# EAGLE design Dumber (EAGLE 5.11)
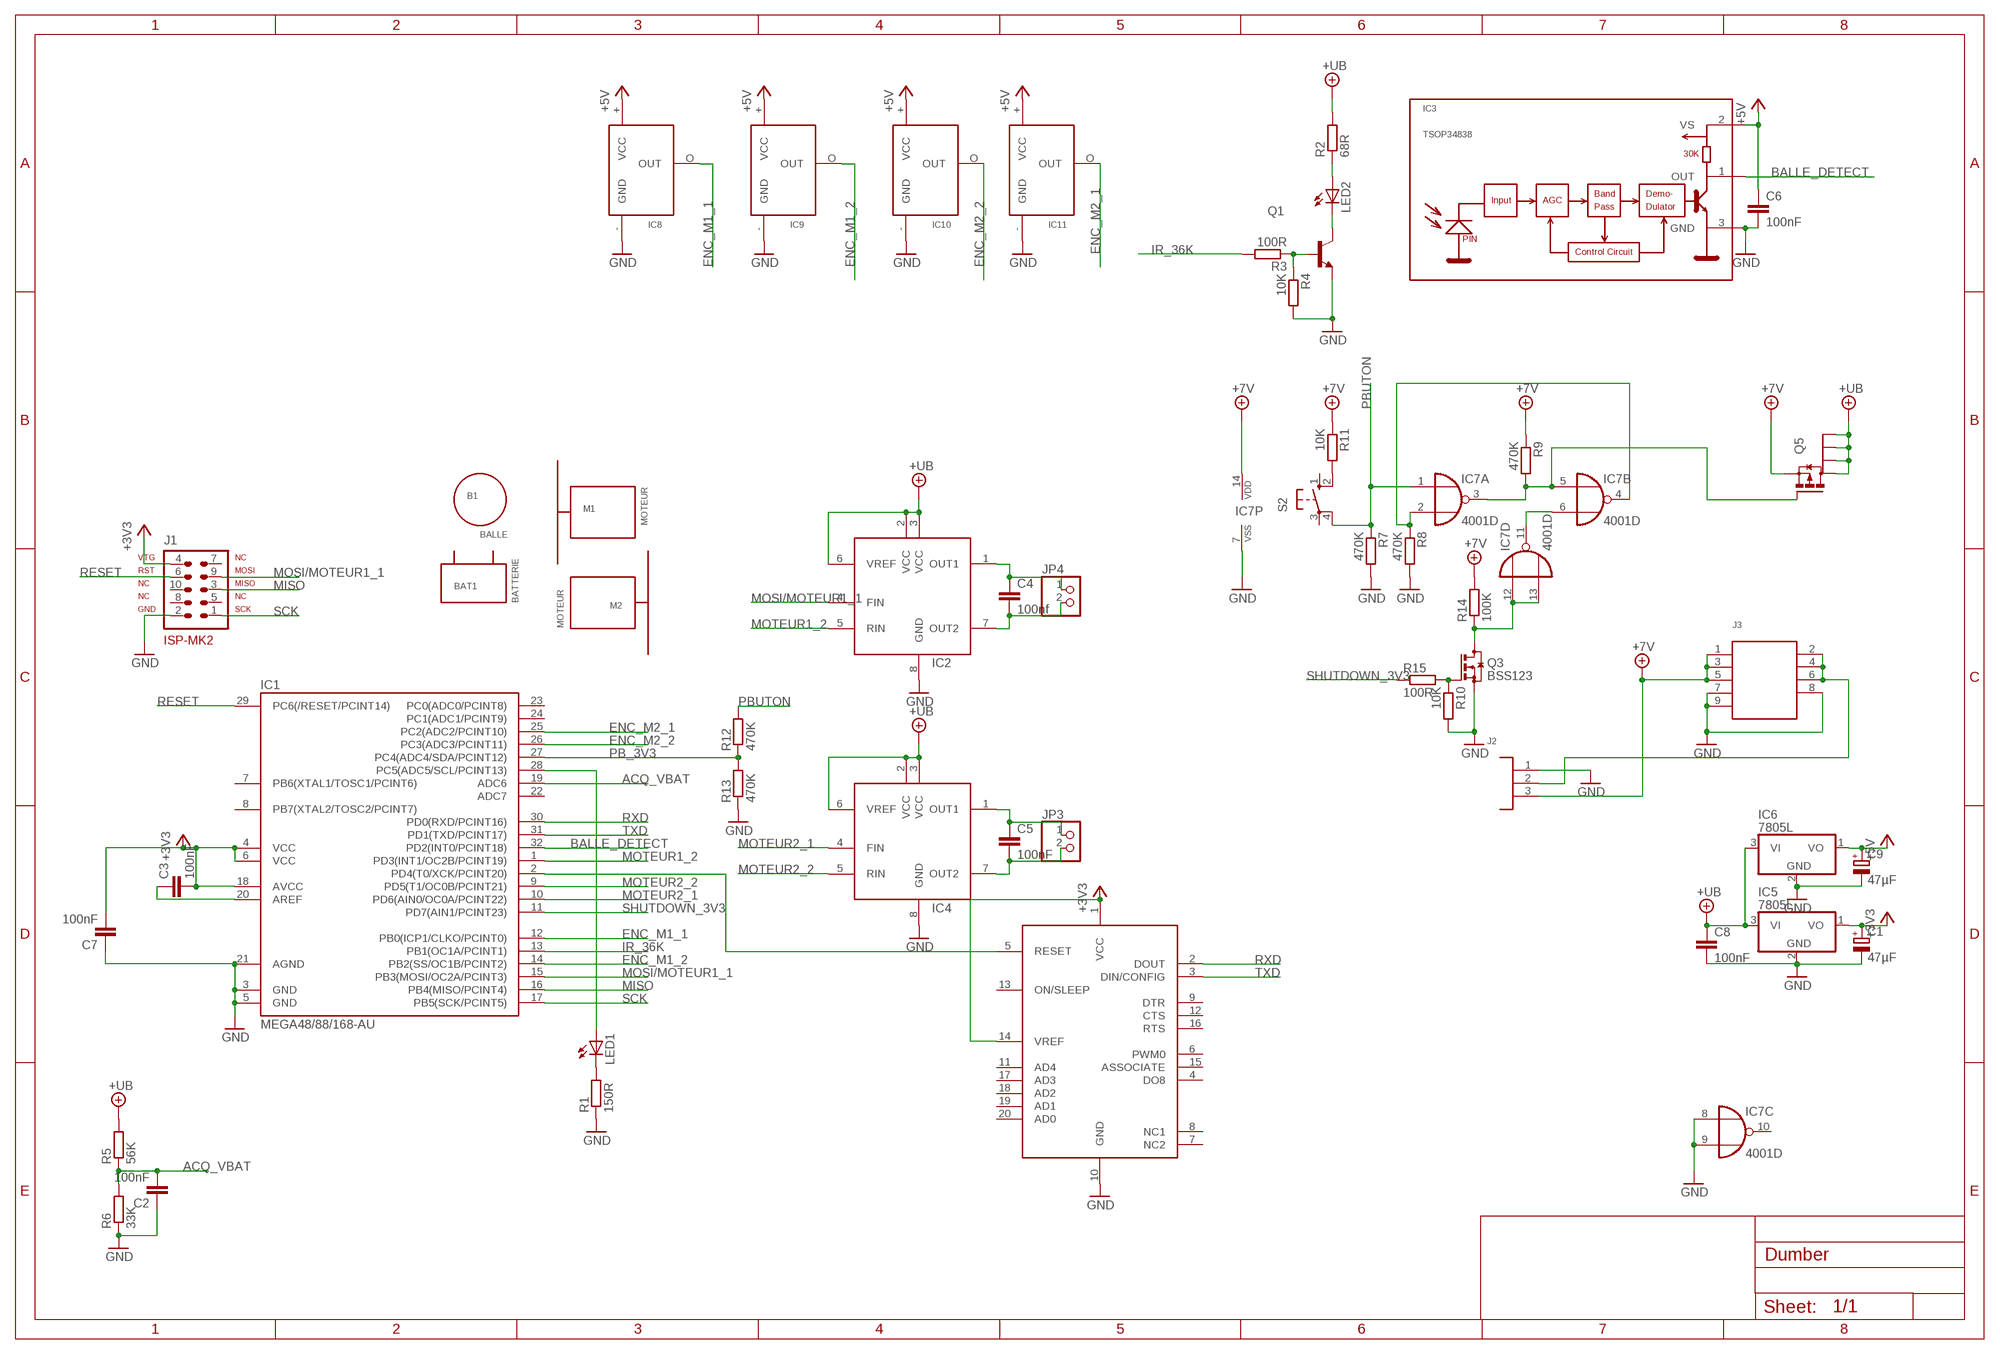
[diagram p0: schematic, sheet 1]

## Parts
B1  BALLE  [BALLE]
BAT1  BATTERIE  [BATTERIE]
C1  47µF  CPOL-EUD/7343-31R  [D/7343-31R]
C2  100nF  C-EUC1206  [C1206]
C3  100nF  C-EUC1206  [C1206]
C4  100nf  C-EUC1206  [C1206]
C5  100nF  C-EUC1206  [C1206]
C6  100nF  C-EUC1206  [C1206]
C7  100nF  C-EUC1206  [C1206]
C8  100nF  C-EUC1206  [C1206]
C9  47µF  CPOL-EUD/7343-31R  [D/7343-31R]
IC1  MEGA48/88/168-AU  [TQFP32-08]
IC2  BD62XX  [SO-08]
IC3  TSOP34838  TSOP2236  [TSOP348]
IC4  BD62XX  [SO-08]
IC5  7805L  [TO92]
IC6  7805L  [TO92]
IC7  4001D  [SO14]
IC8  2SS52M  [2SS]
IC9  2SS52M  [2SS]
IC10  2SS52M  [2SS]
IC11  2SS52M  [2SS]
IC12  XBEE  [XBEE]
J1  AVR-ISP-MK2  [AVR-ISP-10]
J2  3XH  [3XH]
J3  M40-9-F  [M40-600-9]
JP3  PINHD-1X2  [1X02]
JP4  PINHD-1X2  [1X02]
LED1  LEDKA-3528ASYC  [KA-3528ASYC]
LED2  LED5MM  [LED5MM]
M1  MOTEUR  [MOTEUR]
M2  MOTEUR  [MOTEUR]
Q1  BCP56  [SOT223]
Q3  BSS123  [SOT23]
Q5  RTQ030P02TR  [TSMT-6]
R1  150R  R-EU_M0805  [M0805]
R2  68R  R-EU_M0805  [M0805]
R3  100R  R-EU_R1206W  [R1206W]
R4  10K  R-EU_R1206W  [R1206W]
R5  56K  R-EU_M0805  [M0805]
R6  33K  R-EU_M0805  [M0805]
R7  470K  R-EU_R1206W  [R1206W]
R8  470K  R-EU_R1206W  [R1206W]
R9  470K  R-EU_R1206W  [R1206W]
R10  10K  R-EU_R1206W  [R1206W]
R11  10K  R-EU_R1206W  [R1206W]
R12  470K  R-EU_R1206W  [R1206W]
R13  470K  R-EU_R1206W  [R1206W]
R14  100K  R-EU_R1206W  [R1206W]
R15  100R  R-EU_R1206W  [R1206W]
S2  10-XX  [B3F-10XX]

## Nets
+3V3: C1.+ C3.2 C7.2 IC1.4(VCC) IC1.6(VCC) IC1.18(AVCC) IC5.1(VO) IC12.1(VCC) IC12.14(VREF) J1.4(VTG)
+5V: C6.1 C9.+ IC3.2(VS) IC6.1(VO) IC8.+(VCC) IC9.+(VCC) IC10.+(VCC) IC11.+(VCC)
+7V: IC7.14(P:VDD) J2.3 J3.1 J3.3 J3.5 Q5.4(S) R9.1 R11.1 R14.2
+UB: C8.1 IC2.2(VCC) IC2.3(VCC) IC2.6(VREF) IC4.2(VCC) IC4.3(VCC) IC4.6(VREF) IC5.3(VI) IC6.3(VI) Q5.1(D) Q5.2(D) Q5.5(D) Q5.6(D) R2.2 R5.2
ACQ_VBAT: C2.2 IC1.19(ADC6) R5.1 R6.2
BALLE_DETECT: IC1.32(PD2(INT0/PCINT18)) IC3.1(OUT)
ENC_M1_1: IC1.12(PB0(ICP1/CLKO/PCINT0)) IC8.O(OUT)
ENC_M1_2: IC1.14(PB2(SS/OC1B/PCINT2)) IC9.O(OUT)
ENC_M2_1: IC1.25(PC2(ADC2/PCINT10)) IC11.O(OUT)
ENC_M2_2: IC1.26(PC3(ADC3/PCINT11)) IC10.O(OUT)
GND: C1.- C2.1 C6.2 C7.1 C8.2 C9.- IC1.3(GND) IC1.5(GND) IC1.21(AGND) IC2.8(GND) IC3.3(GND) IC4.8(GND) IC5.2(GND) IC6.2(GND) IC7.7(P:VSS) IC7.8(C:I0) IC7.9(C:I1) IC8.-(GND) IC9.-(GND) IC10.-(GND) IC11.-(GND) IC12.10(GND) J1.2(GND) J2.1 J3.7 J3.8 J3.9 Q1.3(E) Q3.2(S) R1.1 R4.2 R6.1 R7.2 R8.2 R10.2 R13.1
IR_36K: IC1.13(PB1(OC1A/PCINT1)) R3.2
MISO: IC1.16(PB4(MISO/PCINT4)) J1.3(MISO)
MOSI/MOTEUR1_1: IC1.15(PB3(MOSI/OC2A/PCINT3)) IC2.4(FIN) J1.9(MOSI)
MOTEUR1_2: IC1.1(PD3(INT1/OC2B/PCINT19)) IC2.5(RIN)
MOTEUR2_1: IC1.10(PD6(AIN0/OC0A/PCINT22)) IC4.4(FIN)
MOTEUR2_2: IC1.9(PD5(T1/OC0B/PCINT21)) IC4.5(RIN)
N$1: R11.2 S2.2(S1)
N$2: IC1.28(PC5(ADC5/SCL/PCINT13)) LED1.A
N$3: LED1.C R1.2
N$5: C3.1 IC1.20(AREF)
N$6: IC1.2(PD4(T0/XCK/PCINT20)) IC12.5(RESET)
N$9: C4.1 IC2.1(OUT1) JP4.1
N$10: C4.2 IC2.7(OUT2) JP4.2
N$11: C5.1 IC4.1(OUT1) JP3.1
N$12: C5.2 IC4.7(OUT2) JP3.2
N$14: Q1.1(B) R3.1 R4.1
N$15: LED2.K(C) Q1.2(C)
N$16: LED2.A R2.1
N$17: IC7.3(A:O) IC7.5(B:I0) Q5.3(G) R9.2
N$18: IC7.12(D:I0) IC7.13(D:I1) Q3.3(D) R14.1
N$19: J2.2 J3.2 J3.4 J3.6
N$20: Q3.1(G) R10.1 R15.2
N$21: IC7.2(A:I1) IC7.4(B:O) R8.1
PB_3V3: IC1.27(PC4(ADC4/SDA/PCINT12)) R12.1 R13.2
PBUTON: IC7.1(A:I0) R7.1 R12.2 S2.4(P1)
RESET: IC1.29(PC6(/RESET/PCINT14)) J1.6(RST)
RXD: IC1.30(PD0(RXD/PCINT16)) IC12.2(DOUT)
SCK: IC1.17(PB5(SCK/PCINT5)) J1.1(SCK)
SHUTDOWN: IC7.6(B:I1) IC7.11(D:O)
SHUTDOWN_3V3: IC1.11(PD7(AIN1/PCINT23)) R15.1
TXD: IC1.31(PD1(TXD/PCINT17)) IC12.3(DIN/CONFIG)
Unconnected: IC1.7(PB6(XTAL1/TOSC1/PCINT6)) IC1.8(PB7(XTAL2/TOSC2/PCINT7)) IC1.22(ADC7) IC1.23(PC0(ADC0/PCINT8)) IC1.24(PC1(ADC1/PCINT9)) IC7.10(C:O) IC12.4(DO8) IC12.6(PWM0) IC12.7(NC2) IC12.8(NC1) IC12.9(DTR) IC12.11(AD4) IC12.12(CTS) IC12.13(ON/SLEEP) IC12.15(ASSOCIATE) IC12.16(RTS) IC12.17(AD3) IC12.18(AD2) IC12.19(AD1) IC12.20(AD0) J1.5(NC) J1.7(NC) J1.8(NC) J1.10(NC) S2.1(S) S2.3(P)

## Library data of the parts
B1 = dumber:BALLE
BAT1 = dumber:BATTERIE
C1 C9 = rcl:CPOL-EU: POLARIZED CAPACITOR, European symbol
C2-C8 = rcl:C-EU: CAPACITOR, European symbol
IC1 = avr-5:MEGA48/88/168
IC2 IC4 = transistor-power:BD62XX
IC3 = vishay-1:TSOP2236
IC5 IC6 = linear:78*: Positive VOLTAGE REGULATOR Source: http://cache.national.com/ds/LM/LM78L05.pdf http://www.fairchildsemi.com/ds/LM/LM7805.pdf
IC7 = 40xx:4001: Quad 2-input NOR
IC8-IC11 = dumber:2SS52M
IC12 = Xbee:XBEE
J1 = avr-5:AVR-ISP-MK2
J2 = con-jst:3XH
J3 = con-harwing:M40-9
JP3 JP4 = pinhead:PINHD-1X2: PIN HEADER
LED1 LED2 = led:LED: LED OSRAM: - CHIPLED LG R971, LG N971, LY N971, LG Q971, LY Q971, LO R971, LY R971 LH N974, LH R974 LS Q976, LO Q976, LY Q976 LO Q996 - Hyper CHIPLED LW Q18S LB Q993, LB Q99A, LB R99A - SideLED LS A670, LO A670, LY A670, LG A670, LP A670 LB A673, LV A673, LT A673, LW A673 LH A674 LY A675 LS A676, LA A676, LO A676, LY A676, LW A676 LS A679, LY A679, LG A679 - Hyper Micro SIDELED® LS Y876, LA Y876, LO Y876, LY Y876 LT Y87S - SmartLED LW L88C, LW L88S LB L89C, LB L89S, LG L890 LS L89K, LO L89K, LY L89K LS L896, LA L896, LO L896, LY L896 - TOPLED LS T670, LO T670, LY T670, LG T670, LP T670 LSG T670, LSP T670, LSY T670, LOP T670, LYG T670 LG T671, LOG T671, LSG T671 LB T673, LV T673, LT T673, LW T673 LH T674 LS T676, LA T676, LO T676, LY T676, LB T676, LH T676, LSB T676, LW T676 LB T67C, LV T67C, LT T67C, LS T67K, LO T67K, LY T67K, LW E67C LS E67B, LA E67B, LO E67B, LY E67B, LB E67C, LV E67C, LT E67C LW T67C LS T679, LY T679, LG T679 LS T770, LO T770, LY T770, LG T770, LP T770 LB T773, LV T773, LT T773, LW T773 LH T774 LS E675, LA E675, LY E675, LS T675 LS T776, LA T776, LO T776, LY T776, LB T776 LHGB T686 LT T68C, LB T68C - Hyper Mini TOPLED® LB M676 - Mini TOPLED Santana® LG M470 LS M47K, LO M47K, LY M47K Source: http://www.osram.convergy.de LUXEON: - LUMILED® LXK2-PW12-R00, LXK2-PW12-S00, LXK2-PW14-U00, LXK2-PW14-V00 LXK2-PM12-R00, LXK2-PM12-S00, LXK2-PM14-U00 LXK2-PE12-Q00, LXK2-PE12-R00, LXK2-PE12-S00, LXK2-PE14-T00, LXK2-PE14-U00 LXK2-PB12-K00, LXK2-PB12-L00, LXK2-PB12-M00, LXK2-PB14-N00, LXK2-PB14-P00, LXK2-PB14-Q00 LXK2-PR12-L00, LXK2-PR12-M00, LXK2-PR14-Q00, LXK2-PR14-R00 LXK2-PD12-Q00, LXK2-PD12-R00, LXK2-PD12-S00 LXK2-PH12-R00, LXK2-PH12-S00 LXK2-PL12-P00, LXK2-PL12-Q00, LXK2-PL12-R00 Source: www.luxeon.com KINGBRIGHT: KA-3528ASYC Source: www.kingbright.com
M1 M2 = dumber:MOTEUR
Q1 = transistor-npn:BCP56
Q3 = transistor-small-signal:BSS123: N-CHANNEL MOS FET
Q5 = dumber:RTQ030P02TR
R1-R15 = rcl:R-EU_: RESISTOR, European symbol
S2 = switch-omron:10-XX: OMRON SWITCH

## Board
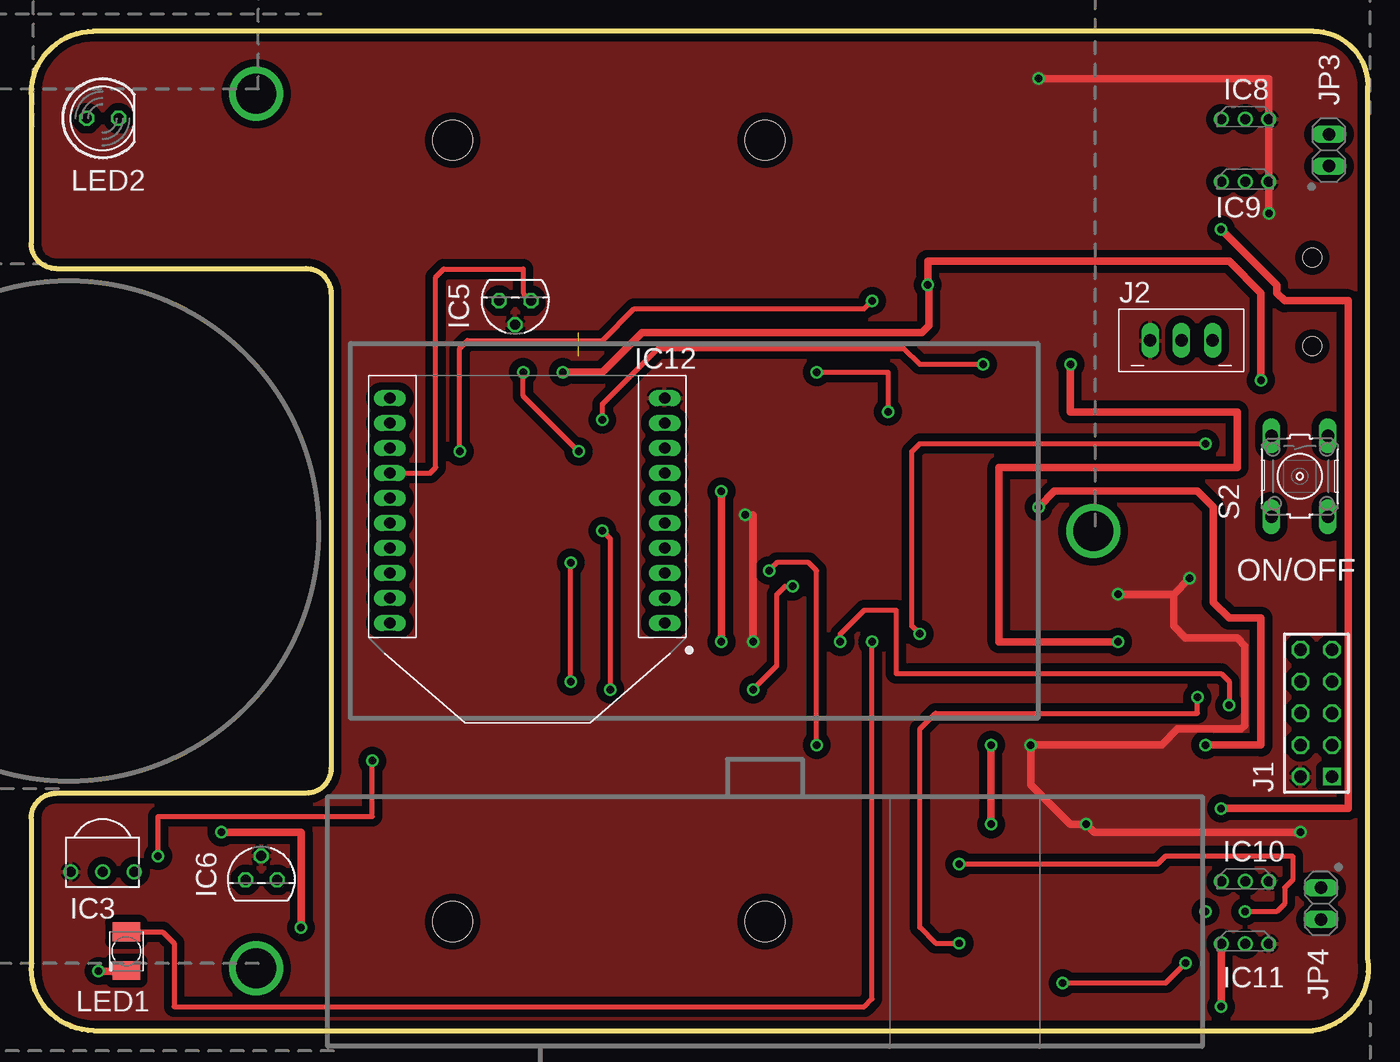
[diagram p1: board, top side]
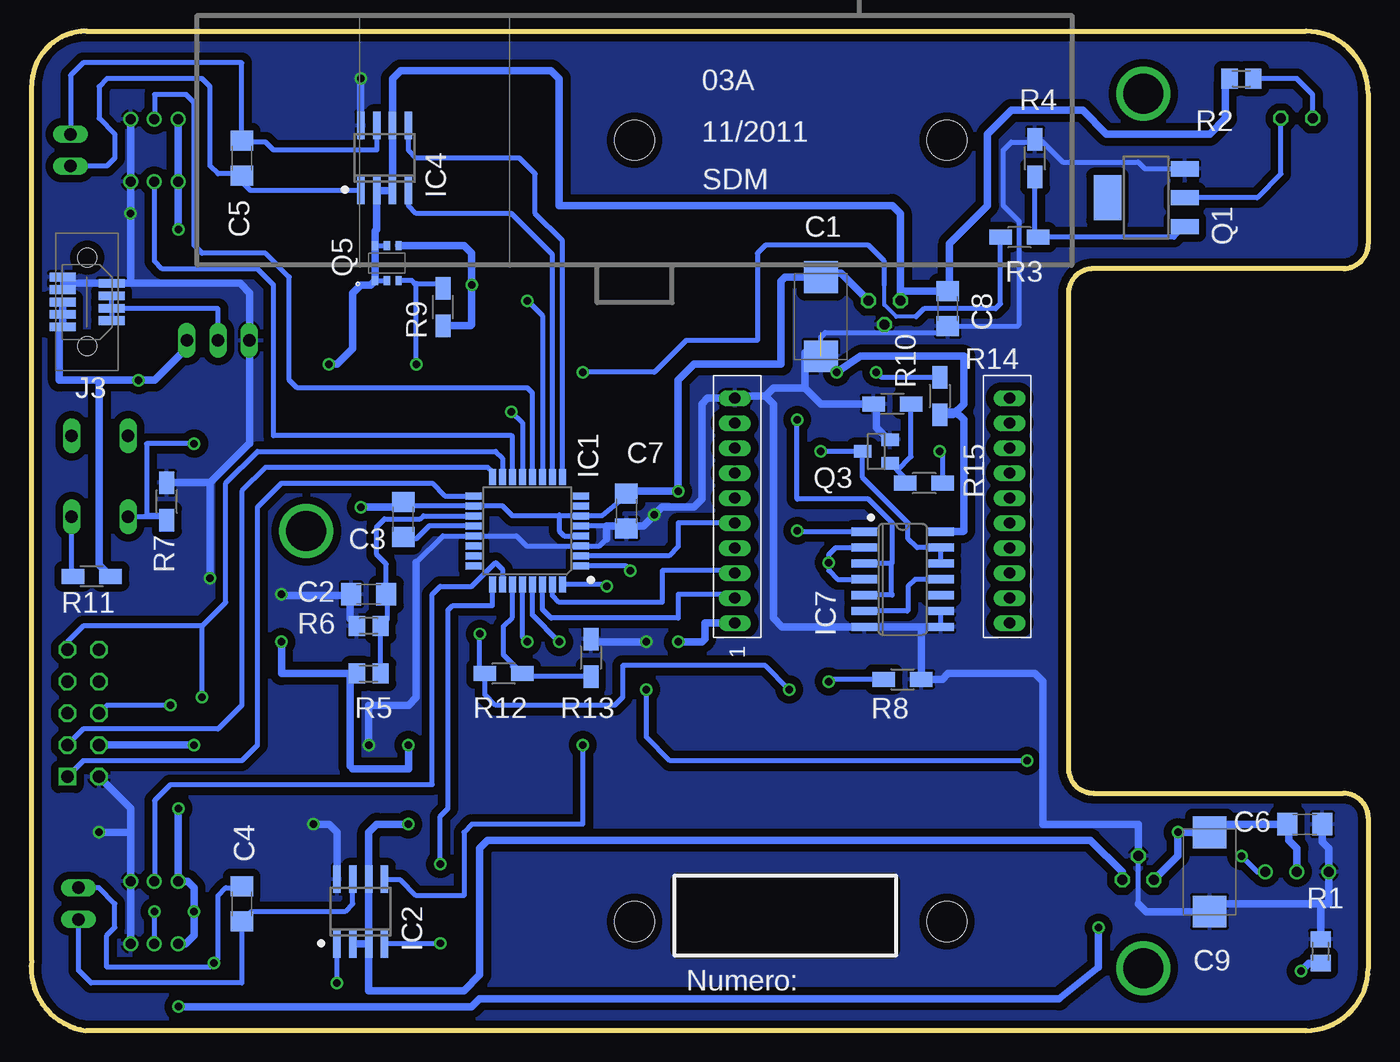
[diagram p2: board, bottom side, seen from below]

Size 107.02 x 80 mm. Coordinates in mm from the lower left corner, seen from the top.
Outline: 5,0 102.62,0 arc90 106.98,5.63 106.98,75.63 arc90 102.62,80 5,80 arc90 0,75 0,63 arc90 2,61 22,61 arc-90 24,59 24,21 arc-90 22,19 2,19 arc90 0,17 0,5 arc90 5,0
Copper layers (1*16): Top 0.035mm / dielectric 1.5mm / Bottom 0.035mm
Design rules "PCB-POOL Standard": minimum track width 0.15mm, minimum drill 0.3mm, track to track 0.15mm, track to pad 0.15mm, pad to pad 0.15mm, via to via 0.15mm, smd to smd 0.15mm, copper to edge 0.3mm, drill to drill 0.2mm, minimum pad ring 0.2mm, minimum via ring 0.2mm, stop-mask expansion 0.075mm, vias tented up to drill 0mil, thermal gap 0.2mm
tRestrict: 16 lines
bRestrict: area 38.1,6.3 to 55.2,12.1; 16 lines

### Footprints (pad centres in the part's own frame; a part is rotated, then mirrored left to right if it is on the bottom)
D/7343-31R = smd 2.55 x 2.7: + 3.175,0; - -3.175,0
C1206 = smd 1.6 x 1.8: 1 -1.4,0; 2 1.4,0
TQFP32-08 = smd 1.27 x 0.559: 1 -4.293,2.8; 2 -4.293,2; 3 -4.293,1.2; 4 -4.293,0.4; 5 -4.293,-0.4; 6 -4.293,-1.2; 7 -4.293,-2; 8 -4.293,-2.8; 17 4.293,-2.8; 18 4.293,-2; 19 4.293,-1.2; 20 4.293,-0.4; 21 4.293,0.4; 22 4.293,1.2; 23 4.293,2; 24 4.293,2.8 | smd 0.559 x 1.27: 9 -2.8,-4.293; 10 -2,-4.293; 11 -1.2,-4.293; 12 -0.4,-4.293; 13 0.4,-4.293; 14 1.2,-4.293; 15 2,-4.293; 16 2.8,-4.293; 25 2.8,4.293; 26 2,4.293; 27 1.2,4.293; 28 0.4,4.293; 29 -0.4,4.293; 30 -1.2,4.293; 31 -2,4.293; 32 -2.8,4.293
SO-08 = smd 0.6 x 2.2: 1 -1.905,-2.6; 2 -0.635,-2.6; 3 0.635,-2.6; 4 1.905,-2.6; 5 1.905,2.6; 6 0.635,2.6; 7 -0.635,2.6; 8 -1.905,2.6
TSOP348 = drill 0.8 round: 1 -2.54,0; 2 0,0; 3 2.54,0
TO92 = drill 0.8 octagon: 1 -1.27,0; 2 0,1.905; 3 1.27,0
SO14 = smd 0.66 x 2.032: 1 -3.81,-3.073; 2 -2.54,-3.073; 3 -1.27,-3.073; 4 0,-3.073; 5 1.27,-3.073; 6 2.54,-3.073; 7 3.81,-3.073; 8 3.81,3.073; 9 2.54,3.073; 10 1.27,3.073; 11 0,3.073; 12 -1.27,3.073; 13 -2.54,3.073; 14 -3.81,3.073
2SS = drill 0.8 round: + 1.905,-0.584; - -1.905,-0.584; O 0,-0.584
XBEE = drill 0.9 pad 1.27 long: 1 -11,9; 2 -11,7; 3 -11,5; 4 -11,3; 5 -11,1; 6 -11,-1; 7 -11,-3; 8 -11,-5; 9 -11,-7; 10 -11,-9; 11 11,-9; 12 11,-7; 13 11,-5; 14 11,-3; 15 11,-1; 16 11,1; 17 11,3; 18 11,5; 19 11,7; 20 11,9
AVR-ISP-10 = drill 1 square: 1 -5.08,-1.27 | drill 1 octagon: 2 -5.08,1.27; 3 -2.54,-1.27; 4 -2.54,1.27; 5 0,-1.27; 6 0,1.27; 7 2.54,-1.27; 8 2.54,1.27; 9 5.08,-1.27; 10 5.08,1.27
3XH = drill 1 long: 1 -2.5,0; 2 0,0; 3 2.5,0
M40-600-9 = smd 0.7 x 2.08: 1 -2,1.92; 2 -1.5,-2; 3 -1,1.92; 4 -0.5,-2; 5 0,1.92; 6 0.5,-2; 7 1,1.92; 8 1.5,-2; 9 2,1.92 | hole 1.5: -3.55,-0.04; 3.55,-0.04
1X02 = drill 1 long: 1 -1.27,0; 2 1.27,0
KA-3528ASYC = smd 1.5 x 2.2: A -1.55,0; C 1.55,0
LED5MM = drill 0.8 octagon: A -1.27,0; K 1.27,0
MOTEUR = hole 3.2: 10,0; 10,-25
SOT223 = smd 1.219 x 2.235: 1 -2.311,-3.099; 2 0,-3.099; 3 2.311,-3.099 | smd 3.6 x 2.2: 4 0,3.099
SOT23 = smd 1 x 1.4: 1 -0.95,-1.1; 2 0.95,-1.1; 3 0,1.1
TSMT-6 = smd 0.5 x 0.7: 1 0.5,-0.6; 2 1.45,-0.6; 3 2.4,-0.6; 4 2.4,2.2; 5 1.45,2.2; 6 0.5,2.2
M0805 = smd 1.3 x 1.6: 1 -0.95,0; 2 0.95,0
R1206W = smd 1.8 x 1.2: 1 -1.499,0; 2 1.499,0
B3F-10XX = drill 1 long: 1 -3.251,2.261; 2 3.251,2.261; 3 -3.251,-2.261; 4 3.251,-2.261

### Placement (x,y rotation side)
B1  3,40 0 top
BAT1  25.57,25 90 top
C1  43.81,57.15 90 bottom
C2  80.01,34.93 0 bottom
C3  77.25,40.93 90 bottom
C4  90.17,10.16 270 bottom
C5  90.17,69.85 90 bottom
C6  5.08,16.51 0 bottom
C7  59.37,41.59 90 bottom
C8  33.66,57.79 270 bottom
C9  12.7,12.7 90 bottom
IC1  67.31,40.01 180 bottom
IC2  80.64,9.53 0 bottom
IC3  5.71,12.7 180 top
IC4  78.74,69.85 0 bottom
IC5  38.73,58.42 180 top
IC6  18.41,12.06 0 top
IC7  37.27,36.12 270 bottom
IC8  97.17,72.36 180 top
IC9  97.17,67.36 180 top
IC10  97.17,11.37 180 top
IC11  97.17,6.37 180 top
IC12  39.71,41.63 180 top
J1  102.87,25.4 90 top
J2  92.08,55.25 0 top
J3  102.6,58.33 90 bottom
JP3  103.87,70.48 90 top
JP4  103.23,10.16 270 top
LED1  7.62,6.35 270 top
LED2  5.71,73.02 0 top
M1  33.73,-1.27 90 top
M2  33.73,81.27 270 bottom
Q1  17.78,66.67 90 bottom
Q3  39.37,46.36 90 bottom
Q5  80.01,60.64 0 bottom
R1  3.81,6.35 270 bottom
R2  10.16,76.2 180 bottom
R3  27.94,63.5 180 bottom
R4  26.67,69.85 90 bottom
R5  80.01,28.57 180 bottom
R6  80.01,32.39 0 bottom
R7  96.17,42.37 90 bottom
R8  37.27,28.12 0 bottom
R9  74.06,57.92 90 bottom
R10  38.1,50.16 180 bottom
R11  102.17,36.37 180 bottom
R12  69.22,28.57 180 bottom
R13  62.23,29.84 270 bottom
R14  34.29,50.8 270 bottom
R15  35.56,43.82 180 bottom
S2  101.54,44.37 270 top

### Tracks (layer width: path | path; a pad name or v marks a point on that pad's centre or on a via)
+3V3  (via drill 0.6)
  Top 0.406: IC5.1 39.37,59.05 39.37,60.96 33.02,60.96 32.38,60.33 32.38,45.09 31.93,44.63 IC12.14
  Top 0.61: v55.24,43.18 v55.24,31.11 | v93.98,22.86 98.42,22.86 98.42,33.02 95.88,33.02 94.61,34.29 94.61,41.91 93.34,43.18 81.91,43.18 v80.64,41.91
  Bottom 0.406: IC1.6 61.35,41.21 59.69,42.55 | IC1.4 64.37,39.61 64.77,40.01 64.77,41.27 64.7,41.21 IC1.6 | IC1.6 68.51,41.21 69.31,42.01 IC1.18 76.92,42.01 C3.2 77.67,41.91 | C7.2 58.74,42.99 58.74,43.18
  Bottom 0.61: IC12.1 53.09,32.63 53.09,31.36 53.34,31.11 v55.24,31.11 | 59.69,42.55 59.05,43.18 58.74,43.18 v55.24,43.18 55.24,52.07 53.97,53.34 46.99,53.34 46.99,60.01 46.67,60.33 C1.+ 43.5,60.64 42.23,60.64 IC5.1 | v93.98,22.86 J1.4 | 77.67,41.91 v80.64,41.91
+5V  (via drill 0.6)
  Top 0.406: 95.25,6.93 IC11.+
  Top 0.61: v15.24,15.88 21.59,15.88 v21.59,8.26 | v95.25,1.91 95.25,6.93 | v95.25,17.78 105.41,17.78 105.41,58.42 100.33,58.42 99.69,59.05 99.69,59.69 v95.25,64.13
  Bottom 0.406: 6.35,16.38 C6.1 | 93.98,9.54 v94,9.53 93.98,9.51 | 95.27,17.76 v95.25,17.78 | 95.25,67.93 IC9.+
  Bottom 0.61: IC9.+ IC8.+ | IC3.2 5.71,14.61 6.35,15.24 6.35,16.38 | C6.1 12.07,16.51 C9.+ v15.24,15.88 15.24,13.97 IC6.1 | v21.59,8.26 21.59,5.08 24.77,2.54 71.12,2.54 71.75,1.91 v95.25,1.91 | 93.98,9.54 93.98,11.43 94.5,11.95 IC10.+ 95.27,17.76 | IC11.+ 94.65,6.95 93.98,7.62 93.98,9.51 | v95.25,64.13 95.25,67.93
+7V  (via drill 0.6)
  Top 0.406: 71.85,59.6 v71.75,59.69
  Top 0.61: v42.54,52.71 45.72,52.71 48.89,55.88 71.31,55.88 71.85,56.42 71.85,59.6 | v98.42,52.07 98.42,59.05 95.88,61.59 71.75,61.59 v71.75,59.69
  Bottom 0.406: 71.75,56.52 71.85,56.42 | R11.1 100.68,36.54 | 104.77,56.07 J3.1 | 32.45,39.94 32.38,40.01 | 34.06,49.53 R14.2
  Bottom 0.61: 71.85,56.42 R9.1 | 71.75,56.52 v71.75,59.69 71.75,62.23 72.37,62.84 Q5.4 | 104.77,56.07 104.77,52.07 101.6,52.07 | J3.1 J3.3 J3.5 | 101.6,52.07 v98.42,52.07 97.16,52.07 94.58,54.65 J2.3 | 32.45,39.94 IC7.14 | 32.38,40.01 32.38,48.9 33.02,49.53 34.06,49.53 | R14.2 33.25,49.3 32.38,50.16 32.38,53.98 40.64,53.98 v42.54,52.71 | 101.6,52.07 101.6,37.29 R11.1
+UB  (via drill 0.6)
  Top 0.61: v76.83,16.51 v76.83,22.86 | v86.99,31.11 77.47,31.11 77.47,45.09 96.52,45.09 96.52,49.53 83.19,49.53 v83.19,53.34
  Bottom 0.406: C8.1 33.52,59.12 | 11.43,75.97 R2.2 | IC5.3 37.46,59.06 37.33,59.19 | 37.46,63.5 37.43,63.47 | Q5.1 Q5.2 | Q5.6 Q5.5
  Bottom 0.61: IC2.3 IC2.2 | IC2.3 IC2.6 80.01,15.88 79.38,16.51 v76.83,16.51 | IC6.3 19.69,12.7 22.23,15.24 70.48,15.24 71.12,14.61 71.12,4.45 72.39,3.17 80.01,3.17 IC2.3 | 33.52,59.12 33.52,63 30.48,66.04 30.48,71.75 28.57,73.66 22.86,73.66 20.96,71.75 12.7,71.75 11.43,73.02 11.43,75.97 | 37.43,63.47 37.46,59.06 | 37.46,63.5 37.46,65.41 38.1,66.04 64.77,66.04 64.77,76.2 65.41,76.83 77.47,76.83 78.11,76.2 IC4.6 IC4.3 IC4.2 79.38,64.13 79.51,64 Q5.6 Q5.1 79.86,59.69 80.64,59.69 81.28,59.05 81.28,54.61 82.55,53.34 v83.19,53.34 | v76.83,22.86 76.83,20.95 81.28,20.95 81.51,21.18 81.51,28.49 81.6,28.57 | 37.33,59.19 C8.1 | 81.6,28.57 86.99,28.57 v86.99,31.11 | 81.6,28.57 R5.2
ACQ_VBAT
  Bottom 0.406: C2.2 78.29,34.6 | R5.1 R6.2 78.51,32.93 78.51,34.83 C2.2 | C2.2 78.61,37.34 79.38,38.1 79.38,40.32 78.74,40.96 75.88,40.96 75.63,41.21 IC1.19
BALLE_DETECT  (via drill 0.6)
  Top 0.406: v10.16,13.97 10.16,17.14 27.3,17.14 v27.3,21.59 | v57.78,27.3 59.69,29.21 59.69,34.93 60.32,35.56 v60.96,35.56
  Bottom 0.406: IC3.1 8.89,12.7 v10.16,13.97 | v27.3,21.59 55.88,21.59 57.78,23.49 v57.78,27.3 | IC1.32 61.11,35.71 v60.96,35.56
ENC_M1_1
  Bottom 0.406: IC8.O 97.16,72.97 97.16,74.93 94.61,74.93 93.98,74.3 93.98,62.87 93.34,62.23 88.27,62.23 86.36,60.33 86.36,52.07 85.72,51.44 67.31,51.44 66.91,51.04 IC1.12
ENC_M1_2
  Bottom 0.406: IC9.O 97.16,67.93 97.16,61.59 96.52,60.96 88.9,60.96 87.63,59.69 87.63,47.62 68.58,47.62 68.51,47.55 IC1.14
ENC_M2_1  (via drill 0.6)
  Top 0.406: v74.3,13.34 90.17,13.34 90.8,13.97 100.97,13.97 100.97,12.06 100.33,11.43 100.33,10.16 99.69,9.53 v97.16,9.53
  Bottom 0.406: v74.3,13.34 74.3,17.14 73.66,17.78 73.66,33.66 73.28,34.03 70.11,34.03 IC1.25 | IC11.O 97.17,9.51 v97.16,9.53
ENC_M2_2
  Bottom 0.406: IC10.O 97.16,11.97 97.16,18.41 95.88,19.68 74.93,19.68 74.93,34.93 74.3,35.56 71.75,35.56 69.85,37.47 69.31,36.93 IC1.26
GND  (via drill 0.6)  (1 unrouted)
  Top 0.406: v99.08,65.41 99.06,65.42
  Top 0.61: v80.64,76.2 99.06,76.2 99.06,65.42 | v57.15,41.27 57.78,41.27 v57.78,31.11 | v101.6,15.88 85.09,15.88 v84.45,16.51 83.19,16.51 80.01,19.68 v80.01,22.86 90.49,22.86 91.76,24.13 96.84,24.13 97.16,24.45 97.16,30.8 96.52,31.43 92.39,31.43 91.44,32.39 91.44,34.93 | 91.44,34.93 v86.99,34.93 | 91.44,34.93 v92.71,36.2
  Bottom 0.406: 50.54,50.8 IC12.10 | J3.9 J3.7 104.02,59.83 | 89.53,55.29 J2.1 89.53,55.21 | C9.- 12.7,10.16 | 18.41,10.16 IC6.2 | 99.06,59.83 99.08,59.84 | 92.71,43.86 92.66,43.86 | 89.58,46.99 89.53,46.99 | IC10.- 99.08,15.85 99.06,15.88 | R6.1 81.2,32.07 | 76.2,37.47 74.06,39.61 IC1.21 68.18,39.61 67.38,38.8 IC1.3 61.52,38.8 60.96,39.37 | 81.51,34.83 C2.1 | v86.99,34.93 86.9,34.83 | 61.75,31.11 R13.1 | 60.96,40.41 IC1.5 | 38.73,55.88 IC5.2 | 38.73,55.88 34.16,55.88 C8.2 28.07,56.39 27.94,56.52 27.94,64.77 29.21,66.04 29.21,70.48 28.57,71.12 26.9,71.12 R4.2 26.44,71.12 26.04,71.12 24.45,69.53 18.41,69.53 17.87,68.99 Q1.3 | 38.73,55.88 43.46,55.88 43.81,55.52 C1.- | 38.41,47.3 Q3.2 | R10.2 39.37,49.94 | IC7.8 IC7.9 | 35.77,32.1 35.56,32.32
  Bottom 0.61: 48.26,50.8 47.62,50.16 47.62,33.02 46.92,32.32 IC7.7 35.56,32.32 IC7.8 | 48.26,50.8 50.54,50.8 | IC11.- IC10.- 99.08,17.8 J1.2 | 104.02,59.83 J3.8 99.06,59.83 90.3,59.83 89.53,59.05 89.53,55.29 | IC8.- IC9.- v99.08,65.41 99.08,59.84 | C6.2 3.68,15.11 3.17,14.61 IC3.3 3.17,10.16 3.81,10.16 | C9.- 11.79,10.16 3.81,10.16 | 12.7,10.16 13.34,9.53 17.78,9.53 18.41,10.16 | IC6.2 18.41,16.51 26.04,16.51 26.04,27.94 26.67,28.57 33.66,28.57 34.1,28.12 R8.2 35.77,32.1 | v80.64,76.2 IC4.8 | 92.71,43.86 R7.2 | 89.53,46.99 89.53,55.21 | 92.71,43.86 89.58,46.99 | IC12.10 52.88,50.63 53.34,50.16 53.34,42.55 53.97,41.91 56.52,41.91 v57.15,41.27 58.02,40.41 60.96,40.41 60.96,39.37 | v101.6,15.88 99.06,15.88 | v84.45,16.51 83.19,16.51 82.55,15.88 IC2.8 | 45.08,51.44 47.62,51.44 48.26,50.8 | 76.2,37.47 76.2,26.67 76.83,26.04 80.01,26.04 v80.01,22.86 | 86.9,34.83 81.51,34.83 81.51,32.93 R6.1 | v92.71,36.2 92.71,43.86 | v57.78,31.11 61.75,31.11 | 45.08,51.44 45.08,54.26 C1.- | 38.41,47.3 39.37,48.26 39.37,49.94 | R10.2 43.81,50.16 45.08,51.44 | R1.1 3.81,10.16
  pour Bottom (isolate 0.61): 0,80.01 107,80.01 107,-0.32 0,-0.32
  pour Top (isolate 0.61): 0,80.01 107,80.01 107,0 0,0
IR_36K  (via drill 0.6)
  Top 0.406: v68.58,49.53 68.58,52.71 v62.86,52.71
  Bottom 0.305: 36.2,57.15 37.78,57.15 38.73,58.1 38.73,59.69
  Bottom 0.406: IC1.13 67.71,48.66 v68.58,49.53 | R3.2 29.44,58.19 29.85,57.79 35.56,57.79 36.2,57.15 | 38.73,59.69 38.73,61.59 40,62.87 48.26,62.87 48.89,62.23 48.89,55.25 54.61,55.25 57.15,52.71 v62.86,52.71
MISO
  Bottom 0.406: J1.3 102.87,24.13 92.08,24.13 90.17,26.04 90.17,43.18 88.27,45.09 70.48,45.09 70.11,44.71 IC1.16
MOSI/MOTEUR1_1  (via drill 0.6)
  Top 0.406: v74.3,6.99 72.39,6.99 71.12,8.26 71.12,24.13 72.39,25.4 93.34,25.4 v93.34,26.67
  Bottom 0.406: J1.9 104.14,31.11 102.87,32.39 93.34,32.39 | 93.34,32.39 91.44,34.29 91.44,43.82 88.9,46.36 69.85,46.36 69.31,45.82 IC1.15 | IC2.4 74.36,6.92 v74.3,6.99 | v93.34,26.67 93.34,32.39
MOTEUR1_2  (via drill 0.6)
  Top 0.406: v59.05,36.83 59.69,37.47 62.23,37.47 62.86,36.83 v62.86,22.86
  Bottom 0.406: IC1.1 59.43,37.21 v59.05,36.83 | v62.86,22.86 62.86,16.51 71.75,16.51 72.39,15.88 72.39,10.79 76.2,10.79 77.47,12.06 78.68,12.06 IC2.5
MOTEUR2_1
  Bottom 0.406: IC4.4 76.83,66.04 76.2,65.41 68.58,65.41 65.31,62.14 IC1.10
MOTEUR2_2
  Bottom 0.406: IC4.5 76.83,70.48 76.2,69.85 67.94,69.85 66.67,68.58 66.67,65.41 64.51,63.24 IC1.9
N$1
  Bottom 0.406: S2.2 103.8,37.13 R11.2
N$2  (via drill 0.6)
  Top 0.406: LED1.A 10.52,7.9 11.43,6.99 11.43,1.91 66.67,1.91 67.31,2.54 v67.31,31.11
  Bottom 0.406: IC1.28 67.71,31.51 v67.31,31.11
N$3  (via drill 0.6)
  Top 0.61: v5.4,4.76 7.58,4.76 LED1.C
  Bottom 0.61: R1.2 4.76,5.4 v5.4,4.76
N$5
  Bottom 0.406: C3.1 77.09,39.37 76.2,39.37 75.16,40.41 IC1.20
N$6
  Bottom 0.406: IC12.5 50.72,40.64 55.24,40.64 55.24,38.73 55.97,38.01 IC1.2
N$7  (via drill 3.2 pad 4.32)
  other vias: 18,75
N$8  (via drill 3.2 pad 4.32)
  other vias: 18,5
N$9  (via drill 0.6)
  Top 0.406: v82.55,3.81 90.8,3.81 v92.39,5.4
  Bottom 0.406: JP4.1 101.6,11.43 100.33,10.16 100.33,8.26 100.97,7.62 100.97,5.08 92.71,5.08 v92.39,5.4 92.08,5.71 92.08,10.79 91.44,11.43 90.3,11.43 C4.1 | v82.55,3.81 IC2.1
N$10
  Bottom 0.406: JP4.2 103.23,4.81 102.23,3.81 90.17,3.81 C4.2 89.41,9.53 81.91,9.53 81.28,10.16 IC2.7
N$11
  Bottom 0.406: JP3.1 100.97,69.21 100.33,69.85 100.33,71.75 101.6,73.02 101.6,75.56 100.97,76.2 93.34,76.2 92.71,75.56 92.71,69.21 92.08,68.58 90.3,68.58 C5.1 90.17,67.94 89.47,67.25 IC4.1
N$12
  Bottom 0.406: JP3.2 103.87,76.47 102.87,77.47 90.17,77.47 C5.2 90.04,71.12 88.27,71.12 87.63,70.48 79.38,70.48 IC4.7
N$13  (via drill 3.2 pad 4.32)
  other vias: 85,40
N$14
  Bottom 0.406: R4.1 26.67,63.73 R3.1 15.54,63.5 Q1.1
N$15
  Bottom 0.406: Q1.2 8.89,66.67 6.98,68.58 LED2.K
N$16
  Bottom 0.406: LED2.A 4.45,74.93 5.71,76.2 R2.1
N$17  (via drill 0.6)
  Top 0.406: v45.72,48.9 45.72,50.16 50.16,54.61 69.85,54.61 71.12,53.34 v76.2,53.34
  Bottom 0.406: 38.17,37.4 38.1,37.47 38.1,40.64 40,42.55 45.72,42.55 v45.72,48.9 | v76.2,53.34 76.2,59.69 | 76.2,59.69 76.2,59.81 74.06,59.81 R9.2 | Q5.3 76.55,60.04 76.2,59.69 | IC7.5 38.1,34.86 38.1,34.93 38.17,34.93 38.17,37.4 | 38.17,37.4 IC7.3
N$18  (via drill 0.6)
  Top 0.406: v39.37,52.71 39.37,50.8 v43.81,46.36
  Bottom 0.406: R14.1 38.96,52.3 v39.37,52.71 | v43.81,46.36 Q3.3 40.47,44.28 36.83,40.64 36.83,39.37 36.12,38.66 IC7.13 IC7.12
N$19
  Bottom 0.406: J3.4 J3.6 | J3.4 J3.2 | J2.2 92.08,57.79 100.56,57.79 J3.4
N$20
  Bottom 0.406: R15.2 37.06,44.19 37.71,44.84 | 37.71,44.84 Q3.1 | R10.1 36.6,45.95 37.71,44.84
N$21  (via drill 0.6)
  Top 0.406: v43.18,27.94 v43.18,37.47
  Bottom 0.406: IC7.4 42.47,36.12 43.18,36.83 v43.18,37.47 43.18,38.1 42.61,38.66 IC7.2 | R8.1 42.99,28.12 v43.18,27.94
PB_3V3
  Bottom 0.406: R13.2 67.49,28.35 R12.1 | 68.51,29.14 67.94,28.57 R12.1 | IC1.27 68.51,33.09 69.22,32.39 69.22,30.07 R12.1
PBUTON  (via drill 0.6)
  Top 0.406: v46.35,27.3 46.35,39.37 v45.72,40.01 | v93.98,46.99 71.12,46.99 70.48,46.36 70.48,32.39 v71.12,31.75
  Bottom 0.406: S2.4 96.42,41.11 R7.1 96.17,40.93 96.52,41.27 97.79,41.27 97.79,46.99 v93.98,46.99 | v46.35,27.3 48.26,29.21 59.69,29.21 59.69,26.67 60.32,26.04 69.85,26.04 70.71,26.9 R12.2 71.12,28.98 v71.12,31.75 | IC7.1 45.65,39.94 v45.72,40.01
RESET  (via drill 0.6)
  Top 0.406: v64.77,31.11 64.77,31.75 66.67,33.66 69.22,33.66 69.22,28.57 95.25,28.57 95.88,27.94 v95.88,26.04
  Bottom 0.406: IC1.29 66.91,33.26 v64.77,31.11 | v95.88,26.04 100.97,26.04 J1.6
RXD
  Bottom 0.406: IC12.2 51,34.93 55.24,34.93 55.24,33.02 65.41,33.02 66.11,33.73 IC1.30
SCK
  Bottom 0.406: J1.1 102.87,21.59 90.17,21.59 88.9,22.86 88.9,41.91 86.99,43.82 74.93,43.82 73.92,42.8 IC1.17
SHUTDOWN
  Bottom 0.406: IC7.6 36.9,33.59 36.83,33.66 36.83,35.56 36.27,36.12 IC7.11
SHUTDOWN_3V3  (via drill 0.6)
  Top 0.406: v34.29,46.36 34.29,54.61 34.92,55.25 45.72,55.25 48.26,57.79 66.67,57.79 v67.31,58.42
  Bottom 0.406: IC1.11 66.11,57.22 v67.31,58.42 | R15.1 34.06,46.13 v34.29,46.36
TXD
  Bottom 0.406: IC12.3 50.91,36.83 56.52,36.83 56.52,34.29 64.77,34.29 65.31,34.83 IC1.31

### Text on the board
tPlace: ON/OFF
bPlace: Numero:
bNames: 03A | 11/2011 | SDM
tDocu: 107 mm | 67 mm | 22 mm | 3.2 mm | pour tous les percages | 70 mm | 42 mm | 83 mm +/- 1mm | 6.5mm | 70 mm | 33 mm +/- 1 mm